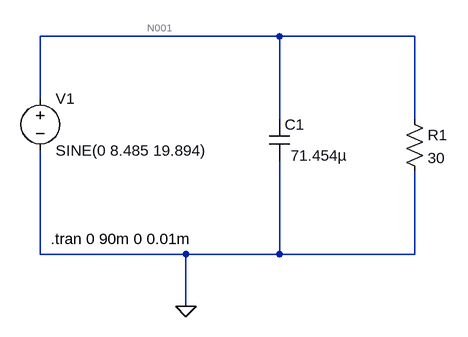
[diagram p0: schematic Lab3_1_7.asc]
Lab3_1_7.asc, the LTspice schematic file:
Version 4
SHEET 1 880 680
WIRE 448 16 80 16
WIRE 656 16 448 16
WIRE 80 112 80 16
WIRE 448 144 448 16
WIRE 656 144 656 16
WIRE 80 352 80 192
WIRE 304 352 80 352
WIRE 448 352 448 208
WIRE 448 352 304 352
WIRE 656 352 656 224
WIRE 656 352 448 352
WIRE 304 432 304 352
FLAG 304 432 0
SYMBOL voltage 80 96 R0
WINDOW 123 0 0 Left 0
WINDOW 39 0 0 Left 0
SYMATTR InstName V1
SYMATTR Value SINE(0 8.485 19.894)
SYMBOL res 640 128 R0
SYMATTR InstName R1
SYMATTR Value 30
SYMBOL cap 432 144 R0
WINDOW 3 33 56 Left 2
SYMATTR Value 71.454µ
SYMATTR InstName C1
TEXT 96 328 Left 2 !.tran 0 90m 0 0.01m

The netlist it stands for:
* Lab3_1_7.asc
V1 N001 0 SINE(0 8.485 19.894)
R1 N001 0 30
C1 N001 0 71.454µ
.tran 0 90m 0 0.01m
.backanno
.end

* Results of the author's LTspice run, read from the files saved beside the schematic
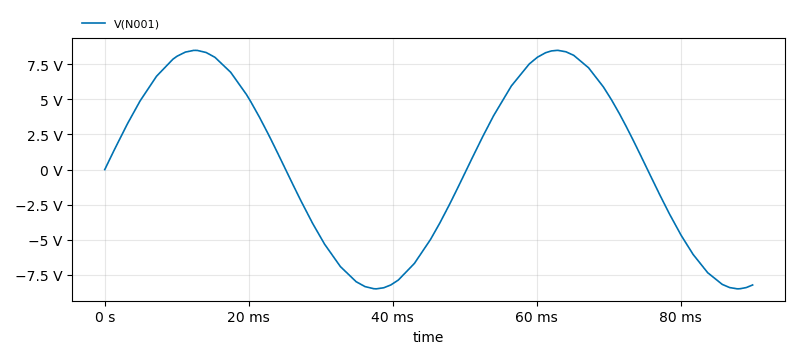
[diagram p1: Transient Analysis of Lab3_1_7.asc, plotted from the saved traces]
* Transient Analysis, 1 run:
*   V(N001): min -8.485 V, max 8.485 V, average 561.6 mV, rms 6.061 V, last -8.212 V